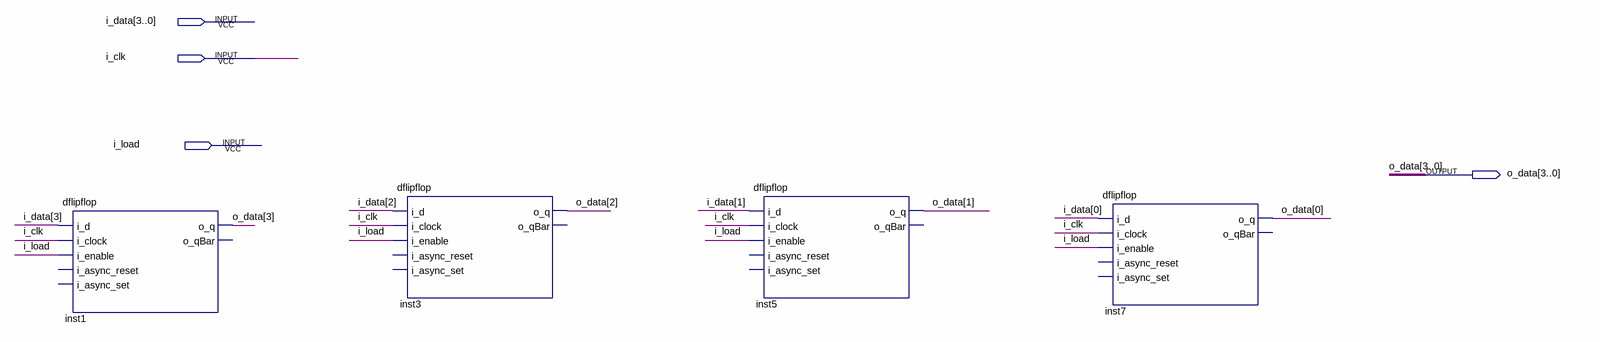
[diagram p0: schematic sheet]
// Quartus schematic Register4bit.bdf as structural Verilog: 4 symbols, 4 pins
module Register4bit (
  input  [3:0] i_data,
  input  i_clk,
  input  i_load,
  output [3:0] o_data
);

  dflipflop inst1 (
    .i_d(i_data[3]), .i_clock(i_clk), .i_enable(i_load), .o_q(o_data[3]));  // open: i_async_reset, i_async_set, o_qBar
  dflipflop inst3 (
    .i_d(i_data[2]), .i_clock(i_clk), .i_enable(i_load), .o_q(o_data[2]));  // open: i_async_reset, i_async_set, o_qBar
  dflipflop inst5 (
    .i_d(i_data[1]), .i_clock(i_clk), .i_enable(i_load), .o_q(o_data[1]));  // open: i_async_reset, i_async_set, o_qBar
  dflipflop inst7 (
    .i_d(i_data[0]), .i_clock(i_clk), .i_enable(i_load), .o_q(o_data[0]));  // open: i_async_reset, i_async_set, o_qBar
endmodule
